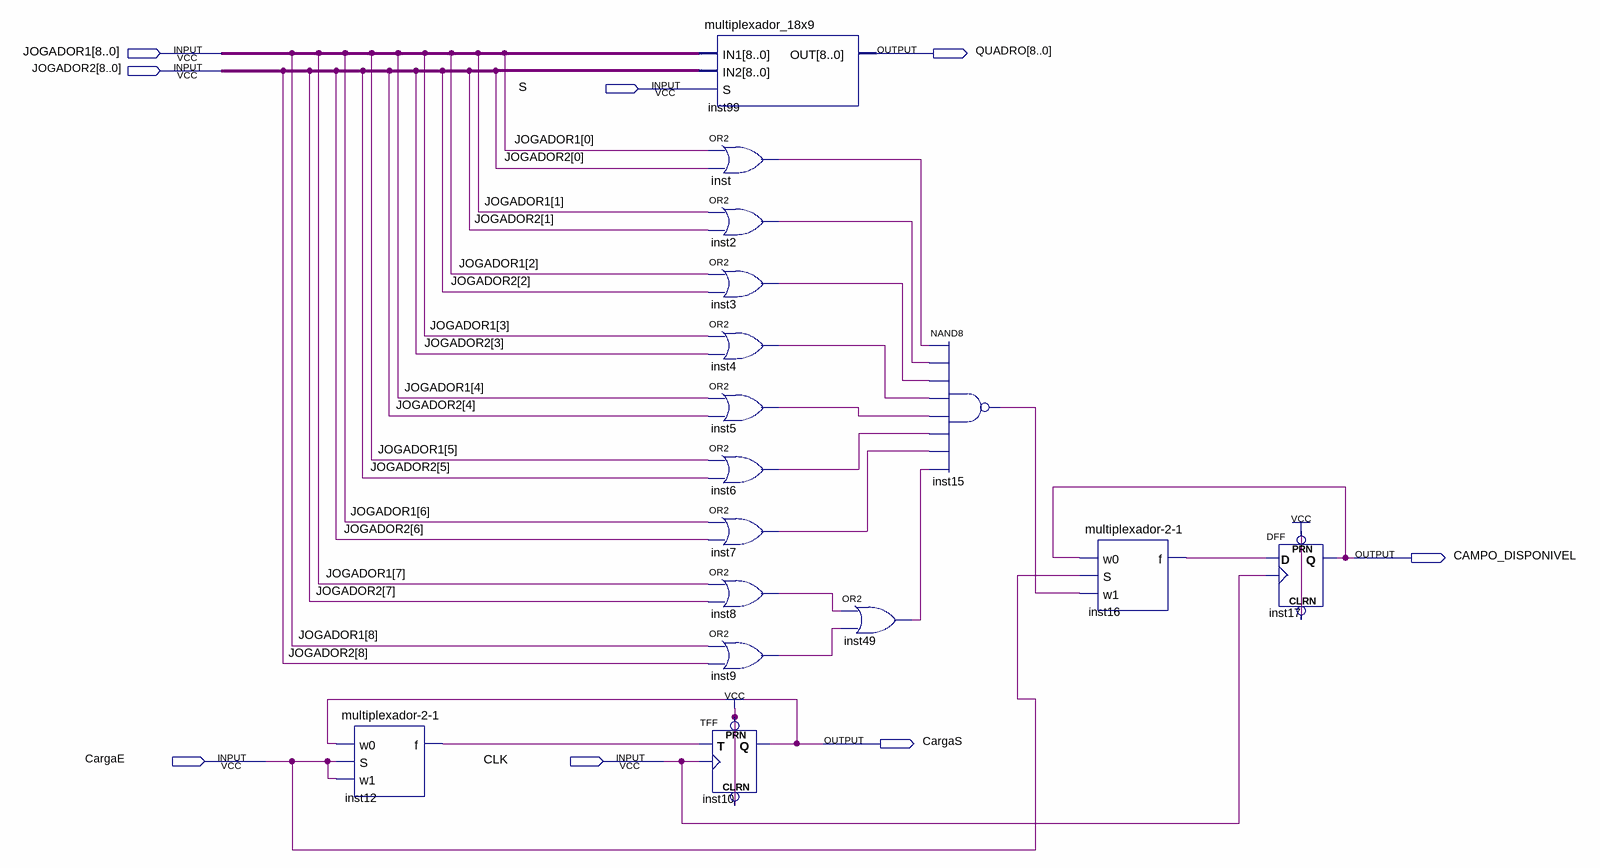
[diagram p0: schematic sheet]
// Quartus schematic mux18x9_extendido.bdf as structural Verilog: 16 symbols, 8 pins
module mux18x9_extendido (
  input  [8:0] JOGADOR1,
  input  [8:0] JOGADOR2,
  input  S,
  input  CargaE,
  input  CLK,
  output [8:0] QUADRO,
  output CAMPO_DISPONIVEL,
  output CargaS
);

  wire inst2_out, inst3_out, inst4_out, inst5_out, inst6_out, inst7_out, inst8_out, inst9_out, inst12_f,
       inst15_out, inst16_f, inst49_out, inst_out;

  \multiplexador-2-1  inst12 (.w0(CargaS), .S(CargaE), .w1(CargaE), .f(inst12_f));
  multiplexador_18x9 inst99 (.IN1(JOGADOR1), .IN2(JOGADOR2), .S(S), .OUT(QUADRO));
  or inst (inst_out, JOGADOR1[0], JOGADOR2[0]);
  or inst2 (inst2_out, JOGADOR1[1], JOGADOR2[1]);
  or inst3 (inst3_out, JOGADOR1[2], JOGADOR2[2]);
  or inst4 (inst4_out, JOGADOR1[3], JOGADOR2[3]);
  or inst5 (inst5_out, JOGADOR1[4], JOGADOR2[4]);
  or inst6 (inst6_out, JOGADOR1[5], JOGADOR2[5]);
  or inst7 (inst7_out, JOGADOR1[6], JOGADOR2[6]);
  or inst8 (inst8_out, JOGADOR1[7], JOGADOR2[7]);
  or inst9 (inst9_out, JOGADOR1[8], JOGADOR2[8]);
  TFF inst10 (.PRN(1'b1), .CLRN(1'b1), .T(inst12_f), .CLK(CLK), .Q(CargaS));
  or inst49 (inst49_out, inst8_out, inst9_out);
  nand inst15 (inst15_out, inst_out, inst2_out, inst3_out, inst4_out, inst5_out, inst6_out, inst7_out, inst49_out);
  \multiplexador-2-1  inst16 (.w0(CAMPO_DISPONIVEL), .S(CargaE), .w1(inst15_out), .f(inst16_f));
  DFF inst17 (.CLRN(1'b1), .CLK(CLK), .D(inst16_f), .PRN(1'b1), .Q(CAMPO_DISPONIVEL));
endmodule
